# Altium schematic sheet DRS4_ADC.SchDoc: My title
size A3; Organization: University of California; Address1: 475 Portola Plaza; Address2: Los Angeles, CA 90095; Revision: R01; SheetNumber: 1; SheetTotal: 1
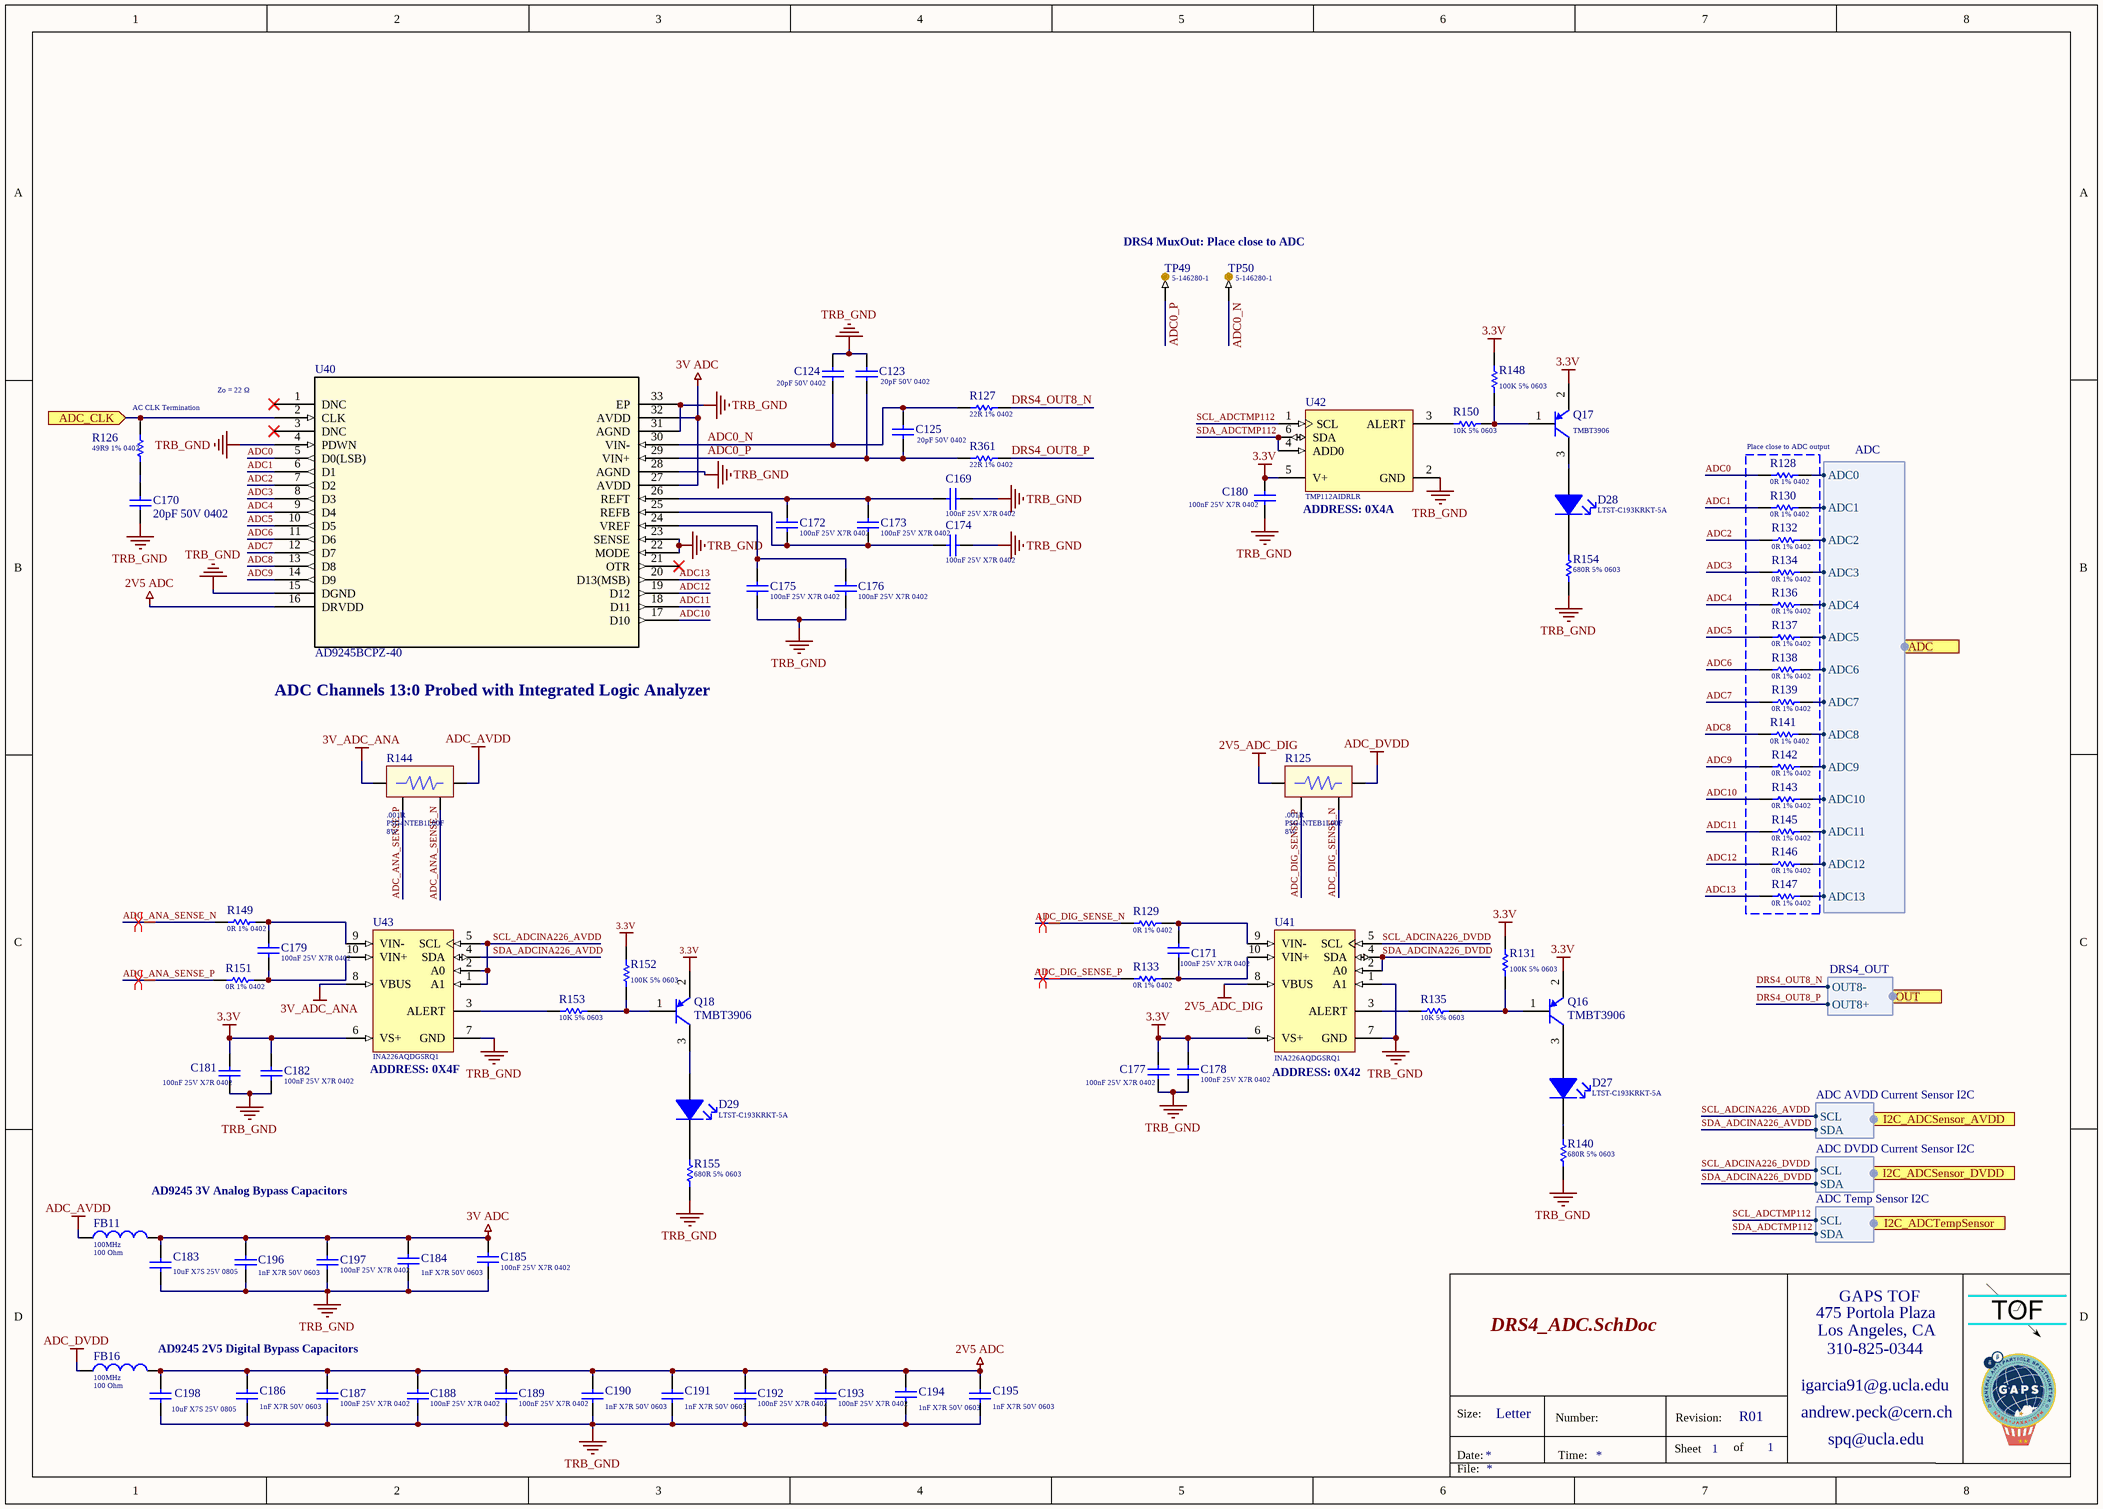
[diagram p0: DRS4_ADC.SchDoc]

## Parts
C123  Capacitance: 20pF 50V 0402  [Cap_Murata_GJM1555C1H200GB01D_20pF]  (hidden comment: Cap_Murata_GJM1555C1H200GB01D_20pF)
C124  Capacitance: 20pF 50V 0402  [Cap_Murata_GJM1555C1H200GB01D_20pF]  (hidden comment: Cap_Murata_GJM1555C1H200GB01D_20pF)
C125  Capacitance: 20pF 50V 0402  [Cap_Murata_GJM1555C1H200GB01D_20pF]  (hidden comment: Cap_Murata_GJM1555C1H200GB01D_20pF)
C169  Capacitance: 100nF 25V X7R 0402  [Cap_Taiyo_Yuden_TMK105B7104KV-FR_100nF]  (hidden comment: Cap_Taiyo_Yuden_TMK105B7104KV-FR_100nF)
C170  Capacitance: 20pF 50V 0402  [Cap_Murata_GJM1555C1H200GB01D_20pF]  (hidden comment: Cap_Murata_GJM1555C1H200GB01D_20pF)
C171  Capacitance: 100nF 25V X7R 0402  [Cap_Taiyo_Yuden_TMK105B7104KV-FR_100nF]  (hidden comment: Cap_Taiyo_Yuden_TMK105B7104KV-FR_100nF)
C172  Capacitance: 100nF 25V X7R 0402  [Cap_Taiyo_Yuden_TMK105B7104KV-FR_100nF]  (hidden comment: Cap_Taiyo_Yuden_TMK105B7104KV-FR_100nF)
C173  Capacitance: 100nF 25V X7R 0402  [Cap_Taiyo_Yuden_TMK105B7104KV-FR_100nF]  (hidden comment: Cap_Taiyo_Yuden_TMK105B7104KV-FR_100nF)
C174  Capacitance: 100nF 25V X7R 0402  [Cap_Taiyo_Yuden_TMK105B7104KV-FR_100nF]  (hidden comment: Cap_Taiyo_Yuden_TMK105B7104KV-FR_100nF)
C175  Capacitance: 100nF 25V X7R 0402  [Cap_Taiyo_Yuden_TMK105B7104KV-FR_100nF]  (hidden comment: Cap_Taiyo_Yuden_TMK105B7104KV-FR_100nF)
C176  Capacitance: 100nF 25V X7R 0402  [Cap_Taiyo_Yuden_TMK105B7104KV-FR_100nF]  (hidden comment: Cap_Taiyo_Yuden_TMK105B7104KV-FR_100nF)
C177  Capacitance: 100nF 25V X7R 0402  [Cap_Taiyo_Yuden_TMK105B7104KV-FR_100nF]  (hidden comment: Cap_Taiyo_Yuden_TMK105B7104KV-FR_100nF)
C178  Capacitance: 100nF 25V X7R 0402  [Cap_Taiyo_Yuden_TMK105B7104KV-FR_100nF]  (hidden comment: Cap_Taiyo_Yuden_TMK105B7104KV-FR_100nF)
C179  Capacitance: 100nF 25V X7R 0402  [Cap_Taiyo_Yuden_TMK105B7104KV-FR_100nF]  (hidden comment: Cap_Taiyo_Yuden_TMK105B7104KV-FR_100nF)
C180  Capacitance: 100nF 25V X7R 0402  [Cap_Taiyo_Yuden_TMK105B7104KV-FR_100nF]  (hidden comment: Cap_Taiyo_Yuden_TMK105B7104KV-FR_100nF)
C181  Capacitance: 100nF 25V X7R 0402  [Cap_Taiyo_Yuden_TMK105B7104KV-FR_100nF]  (hidden comment: Cap_Taiyo_Yuden_TMK105B7104KV-FR_100nF)
C182  Capacitance: 100nF 25V X7R 0402  [Cap_Taiyo_Yuden_TMK105B7104KV-FR_100nF]  (hidden comment: Cap_Taiyo_Yuden_TMK105B7104KV-FR_100nF)
C183  Capacitance: 10uF X7S 25V 0805  [Cap_Murata_ GRM21BC71E106ME11L_10uF]  (hidden comment: Cap_Murata_ GRM21BC71E106ME11L_10uF)
C184  Capacitance: 1nF X7R 50V 0603  [Cap_Kemet_C0603C102J5RACAUTO_1nF]  (hidden comment: Cap_Kemet_C0603C102J5RACAUTO_1nF)
C185  Capacitance: 100nF 25V X7R 0402  [Cap_Taiyo_Yuden_TMK105B7104KV-FR_100nF]  (hidden comment: Cap_Taiyo_Yuden_TMK105B7104KV-FR_100nF)
C186  Capacitance: 1nF X7R 50V 0603  [Cap_Kemet_C0603C102J5RACAUTO_1nF]  (hidden comment: Cap_Kemet_C0603C102J5RACAUTO_1nF)
C187  Capacitance: 100nF 25V X7R 0402  [Cap_Taiyo_Yuden_TMK105B7104KV-FR_100nF]  (hidden comment: Cap_Taiyo_Yuden_TMK105B7104KV-FR_100nF)
C188  Capacitance: 100nF 25V X7R 0402  [Cap_Taiyo_Yuden_TMK105B7104KV-FR_100nF]  (hidden comment: Cap_Taiyo_Yuden_TMK105B7104KV-FR_100nF)
C189  Capacitance: 100nF 25V X7R 0402  [Cap_Taiyo_Yuden_TMK105B7104KV-FR_100nF]  (hidden comment: Cap_Taiyo_Yuden_TMK105B7104KV-FR_100nF)
C190  Capacitance: 1nF X7R 50V 0603  [Cap_Kemet_C0603C102J5RACAUTO_1nF]  (hidden comment: Cap_Kemet_C0603C102J5RACAUTO_1nF)
C191  Capacitance: 1nF X7R 50V 0603  [Cap_Kemet_C0603C102J5RACAUTO_1nF]  (hidden comment: Cap_Kemet_C0603C102J5RACAUTO_1nF)
C192  Capacitance: 100nF 25V X7R 0402  [Cap_Taiyo_Yuden_TMK105B7104KV-FR_100nF]  (hidden comment: Cap_Taiyo_Yuden_TMK105B7104KV-FR_100nF)
C193  Capacitance: 100nF 25V X7R 0402  [Cap_Taiyo_Yuden_TMK105B7104KV-FR_100nF]  (hidden comment: Cap_Taiyo_Yuden_TMK105B7104KV-FR_100nF)
C194  Capacitance: 1nF X7R 50V 0603  [Cap_Kemet_C0603C102J5RACAUTO_1nF]  (hidden comment: Cap_Kemet_C0603C102J5RACAUTO_1nF)
C195  Capacitance: 1nF X7R 50V 0603  [Cap_Kemet_C0603C102J5RACAUTO_1nF]  (hidden comment: Cap_Kemet_C0603C102J5RACAUTO_1nF)
C196  Capacitance: 1nF X7R 50V 0603  [Cap_Kemet_C0603C102J5RACAUTO_1nF]  (hidden comment: Cap_Kemet_C0603C102J5RACAUTO_1nF)
C197  Capacitance: 100nF 25V X7R 0402  [Cap_Taiyo_Yuden_TMK105B7104KV-FR_100nF]  (hidden comment: Cap_Taiyo_Yuden_TMK105B7104KV-FR_100nF)
C198  Capacitance: 10uF X7S 25V 0805  [Cap_Murata_ GRM21BC71E106ME11L_10uF]  (hidden comment: Cap_Murata_ GRM21BC71E106ME11L_10uF)
D27  LTST-C193KRKT-5A  [Led_Lite-On_LTST-C193KGKT-5A_Red]
D28  LTST-C193KRKT-5A  [Led_Lite-On_LTST-C193KGKT-5A_Red]
D29  LTST-C193KRKT-5A  [Led_Lite-On_LTST-C193KGKT-5A_Red]
FB11  Measuring Frequency: 100MHz  Impedance: 100 Ohm  [FB_Wurth_Electronics_742792731_100Ohms]  (hidden comment: 742792731)
FB16  Measuring Frequency: 100MHz  Impedance: 100 Ohm  [FB_Wurth_Electronics_742792731_100Ohms]  (hidden comment: 742792731)
Q16  Series: TMBT3906  [BJT_PNP_Toshiba_TMBT3906]  (hidden comment: BJT_PNP_Toshiba_TMBT3906)
Q17  Series: TMBT3906  [BJT_PNP_Toshiba_TMBT3906]  (hidden comment: BJT_PNP_Toshiba_TMBT3906)
Q18  Series: TMBT3906  [BJT_PNP_Toshiba_TMBT3906]  (hidden comment: BJT_PNP_Toshiba_TMBT3906)
R125  Resistance: .001R  Series: PSG4NTEB1L00F  Parameter 1: 8W  [SRes_KOA_PSG4NTEB1L00F_1mOhm]  (hidden comment: SRes_KOA_PSG4NTEB1L00F_1mOhm)
R126  49R9 1% 0402  [RESC0402(1005)_L]
R127  22R 1% 0402  [RESC0402(1005)_L]
R128  Resistance: 0R 1% 0402  [Res_Vishay_CRCW04020000Z0EDC_0_Ohm]  (hidden comment: Res_Vishay_CRCW04020000Z0EDC_0_Ohm)
R129  Resistance: 0R 1% 0402  [Res_Vishay_CRCW04020000Z0EDC_0_Ohm]  (hidden comment: Res_Vishay_CRCW04020000Z0EDC_0_Ohm)
R130  Resistance: 0R 1% 0402  [Res_Vishay_CRCW04020000Z0EDC_0_Ohm]  (hidden comment: Res_Vishay_CRCW04020000Z0EDC_0_Ohm)
R131  100K 5% 0603  [RESC0603(1608)_N]
R132  Resistance: 0R 1% 0402  [Res_Vishay_CRCW04020000Z0EDC_0_Ohm]  (hidden comment: Res_Vishay_CRCW04020000Z0EDC_0_Ohm)
R133  Resistance: 0R 1% 0402  [Res_Vishay_CRCW04020000Z0EDC_0_Ohm]  (hidden comment: Res_Vishay_CRCW04020000Z0EDC_0_Ohm)
R134  Resistance: 0R 1% 0402  [Res_Vishay_CRCW04020000Z0EDC_0_Ohm]  (hidden comment: Res_Vishay_CRCW04020000Z0EDC_0_Ohm)
R135  10K 5% 0603  [RESC0603(1608)_L]
R136  Resistance: 0R 1% 0402  [Res_Vishay_CRCW04020000Z0EDC_0_Ohm]  (hidden comment: Res_Vishay_CRCW04020000Z0EDC_0_Ohm)
R137  Resistance: 0R 1% 0402  [Res_Vishay_CRCW04020000Z0EDC_0_Ohm]  (hidden comment: Res_Vishay_CRCW04020000Z0EDC_0_Ohm)
R138  Resistance: 0R 1% 0402  [Res_Vishay_CRCW04020000Z0EDC_0_Ohm]  (hidden comment: Res_Vishay_CRCW04020000Z0EDC_0_Ohm)
R139  Resistance: 0R 1% 0402  [Res_Vishay_CRCW04020000Z0EDC_0_Ohm]  (hidden comment: Res_Vishay_CRCW04020000Z0EDC_0_Ohm)
R140  680R 5% 0603  [RESC0603(1608)_L]
R141  Resistance: 0R 1% 0402  [Res_Vishay_CRCW04020000Z0EDC_0_Ohm]  (hidden comment: Res_Vishay_CRCW04020000Z0EDC_0_Ohm)
R142  Resistance: 0R 1% 0402  [Res_Vishay_CRCW04020000Z0EDC_0_Ohm]  (hidden comment: Res_Vishay_CRCW04020000Z0EDC_0_Ohm)
R143  Resistance: 0R 1% 0402  [Res_Vishay_CRCW04020000Z0EDC_0_Ohm]  (hidden comment: Res_Vishay_CRCW04020000Z0EDC_0_Ohm)
R144  Resistance: .001R  Series: PSG4NTEB1L00F  Parameter 1: 8W  [SRes_KOA_PSG4NTEB1L00F_1mOhm]  (hidden comment: SRes_KOA_PSG4NTEB1L00F_1mOhm)
R145  Resistance: 0R 1% 0402  [Res_Vishay_CRCW04020000Z0EDC_0_Ohm]  (hidden comment: Res_Vishay_CRCW04020000Z0EDC_0_Ohm)
R146  Resistance: 0R 1% 0402  [Res_Vishay_CRCW04020000Z0EDC_0_Ohm]  (hidden comment: Res_Vishay_CRCW04020000Z0EDC_0_Ohm)
R147  Resistance: 0R 1% 0402  [Res_Vishay_CRCW04020000Z0EDC_0_Ohm]  (hidden comment: Res_Vishay_CRCW04020000Z0EDC_0_Ohm)
R148  100K 5% 0603  [RESC0603(1608)_N]
R149  Resistance: 0R 1% 0402  [Res_Vishay_CRCW04020000Z0EDC_0_Ohm]  (hidden comment: Res_Vishay_CRCW04020000Z0EDC_0_Ohm)
R150  10K 5% 0603  [RESC0603(1608)_L]
R151  Resistance: 0R 1% 0402  [Res_Vishay_CRCW04020000Z0EDC_0_Ohm]  (hidden comment: Res_Vishay_CRCW04020000Z0EDC_0_Ohm)
R152  100K 5% 0603  [RESC0603(1608)_N]
R153  10K 5% 0603  [RESC0603(1608)_L]
R154  680R 5% 0603  [RESC0603(1608)_L]
R155  680R 5% 0603  [RESC0603(1608)_L]
R361  22R 1% 0402  [RESC0402(1005)_L]
TP49  Series: 5-146280-1  [TP_TE_Connectivity_5-146280-1_1POS]  (hidden comment: TP_TE_Connectivity_5-146280-1_1POS)
TP50  Series: 5-146280-1  [TP_TE_Connectivity_5-146280-1_1POS]  (hidden comment: TP_TE_Connectivity_5-146280-1_1POS)
U40  AD9245  [CP_32_2]  (value not drawn)
U41  INA226AQDGSRQ1  [INA226AQDGSRQ1]
U42  TMP112AIDRLR  [TMP112AIDRLR]
U43  INA226AQDGSRQ1  [INA226AQDGSRQ1]

## Blocks framed on the sheet
Place close to ADC output: R128 R130 R132 R134 R136-R139 R141-R143 R145-R147

## Ports
ADC (harness ADC), ADC_CLK (in), I2C_ADCSensor_AVDD (harness ADC AVDD Current Sensor I2C), I2C_ADCSensor_DVDD (harness ADC DVDD Current Sensor I2C), I2C_ADCTempSensor (harness ADC Temp Sensor I2C), OUT (harness DRS4_OUT)

## Harnesses
ADC: ADC0, ADC1, ADC2, ADC3, ADC4, ADC5, ADC6, ADC7, ADC8, ADC9, ADC10, ADC11, ADC12, ADC13
DRS4_OUT: OUT8+, OUT8-
ADC AVDD Current Sensor I2C: SCL, SDA
ADC Temp Sensor I2C: SCL, SDA
ADC DVDD Current Sensor I2C: SCL, SDA

## Nets
2V5 ADC: C186.2 C187.1 C188.1 C189.1 C190.2 C191.2 C192.1 C193.1 C194.2 C195.2 C198.1 FB16.2 U40.16(DRVDD)
2V5_ADC_DIG: R125.1 U41.8(VBUS)
3.3V: C177.2 C178.2 C180.1 C181.2 C182.2 Q16.2(E) Q17.2(E) Q18.2(E) R131.2 R148.2 R152.2 U41.6(VS+) U42.5(V+) U43.6(VS+)
3V ADC: C183.1 C184.2 C185.1 C196.2 C197.1 FB11.2 U40.27(AVDD) U40.32(AVDD)
3V_ADC_ANA: R144.1 U43.8(VBUS)
ADC_AVDD: FB11.1 R144.2
ADC_DVDD: FB16.1 R125.2
TRB_GND: C123.2 C124.2 C169.1 C170.1 C174.1 C175.2 C176.2 C177.1 C178.1 C180.2 C181.1 C182.1 C183.2 C184.1 C185.2 C186.1 C187.2 C188.2 C189.2 C190.1 C191.1 C192.2 C193.2 C194.1 C195.1 C196.1 C197.2 C198.2 R140.1 R154.1 R155.1 U40.4(PDWN) U40.15(DGND) U40.22(MODE) U40.23(SENSE) U40.28(AGND) U40.31(AGND) U40.33(EP) U41.1(A1) U41.7(GND) U42.2(GND) U43.7(GND)
ADC0: R128.1 U40.5(D0(LSB))
ADC0_N: C124.1 C125.2 R127.2 TP50.1 U40.30(VIN-)
ADC0_P: C123.1 C125.1 R361.2 TP49.1 U40.29(VIN+)
ADC1: R130.1 U40.6(D1)
ADC2: R132.1 U40.7(D2)
ADC3: R134.1 U40.8(D3)
ADC4: R136.1 U40.9(D4)
ADC5: R137.1 U40.10(D5)
ADC6: R138.1 U40.11(D6)
ADC7: R139.1 U40.12(D7)
ADC8: R141.1 U40.13(D8)
ADC9: R142.1 U40.14(D9)
ADC10: R143.1 U40.17(D10)
ADC11: R145.1 U40.18(D11)
ADC12: R146.1 U40.19(D12)
ADC13: R147.1 U40.20(D13(MSB))
ADC_ANA_SENSE_N: R144.3 R149.1
ADC_ANA_SENSE_P: R144.4 R151.1
ADC_CLK: R126.2 U40.2(CLK) ; port ADC_CLK
ADC_DIG_SENSE_N: R125.3 R129.1
ADC_DIG_SENSE_P: R125.4 R133.1
DRS4_OUT8_N: R127.1 ; port OUT.OUT8-
DRS4_OUT8_P: R361.1 ; port OUT.OUT8+
SCL_ADCINA226_AVDD: U43.1(A1) U43.2(A0) U43.5(SCL) ; port I2C_ADCSensor_AVDD.SCL
SCL_ADCINA226_DVDD: U41.5(SCL) ; port I2C_ADCSensor_DVDD.SCL
SCL_ADCTMP112: U42.1(SCL) ; port I2C_ADCTempSensor.SCL
SDA_ADCINA226_AVDD: U43.4(SDA) ; port I2C_ADCSensor_AVDD.SDA
SDA_ADCINA226_DVDD: U41.2(A0) U41.4(SDA) ; port I2C_ADCSensor_DVDD.SDA
SDA_ADCTMP112: U42.4(ADD0) U42.6(SDA) ; port I2C_ADCTempSensor.SDA
NetC169_2: C169.2 C172.1 C173.1 U40.26(REFT)
NetC170_2: C170.2 R126.1
NetC171_1: C171.1 R133.2 U41.10(VIN+)
NetC171_2: C171.2 R129.2 U41.9(VIN-)
NetC172_2: C172.2 C173.2 C174.2 U40.25(REFB)
NetC175_1: C175.1 C176.1 U40.24(VREF)
NetC179_1: C179.1 R151.2 U43.10(VIN+)
NetC179_2: C179.2 R149.2 U43.9(VIN-)
NetD27_1: D27.1(K) R140.2
NetD27_2: D27.2(A) Q16.3(C)
NetD28_1: D28.1(K) R154.2
NetD28_2: D28.2(A) Q17.3(C)
NetD29_1: D29.1(K) R155.2
NetD29_2: D29.2(A) Q18.3(C)
NetQ16_1: Q16.1(B) R131.1 R135.1
NetQ17_1: Q17.1(B) R148.1 R150.1
NetQ18_1: Q18.1(B) R152.1 R153.1
NetR128_2: R128.2 ; port ADC.ADC0
NetR130_2: R130.2 ; port ADC.ADC1
NetR132_2: R132.2 ; port ADC.ADC2
NetR134_2: R134.2 ; port ADC.ADC3
NetR135_2: R135.2 U41.3(ALERT)
NetR136_2: R136.2 ; port ADC.ADC4
NetR137_2: R137.2 ; port ADC.ADC5
NetR138_2: R138.2 ; port ADC.ADC6
NetR139_2: R139.2 ; port ADC.ADC7
NetR141_2: R141.2 ; port ADC.ADC8
NetR142_2: R142.2 ; port ADC.ADC9
NetR143_2: R143.2 ; port ADC.ADC10
NetR145_2: R145.2 ; port ADC.ADC11
NetR146_2: R146.2 ; port ADC.ADC12
NetR147_2: R147.2 ; port ADC.ADC13
NetR150_2: R150.2 U42.3(ALERT)
NetR153_2: R153.2 U43.3(ALERT)

Not connected (* = marked no-connect by the designer): U40 1(DNC)* 3(DNC)* 21(OTR)*

## Layout directives
differential pair: ADC_ANA_SENSE_N, ADC_ANA_SENSE_P, ADC_DIG_SENSE_N, ADC_DIG_SENSE_P

## Notes on the sheet
- DRS4 MuxOut: Place close to ADC
- (near R126) AC CLK Termination
- Zo = 22 Ω
- ADDRESS: 0X4A
- ADC Channels 13:0 Probed with Integrated Logic Analyzer
- (near U43) ADDRESS: 0X4F
- (near U41) ADDRESS: 0X42
- AD9245 3V Analog Bypass Capacitors
- (near FB16) AD9245 2V5 Digital Bypass Capacitors
- 475 Portola Plaza
- GAPS TOF
- igarcia91@g.ucla.edu
- Los Angeles, CA
- 310-825-0344
- Size:
- Date:
- Letter
- Number:
- Time:
- Sheet
- Revision:
- of
- andrew.peck@cern.ch
- spq@ucla.edu
- File:

## Library data of the parts
C123-C125 C170 = Cap_Murata_GJM1555C1H200GB01D_20pF: Multilayer Ceramic Capacitors MLCC - SMD/SMT 0402 20pF 50Volts C0G 2%; Supplier 1: Mouser; Supplier Part Number 1: 81-GJM1555C1H200GB01
C169 C171-C182 C185 C187-C189 C192 C193 C197 = Cap_Taiyo_Yuden_TMK105B7104KV-FR_100nF: CAP CER 100nF 25V X7R 0402; Supplier 1: Mouser; Supplier Part Number 1: 963-TMK105B7104KV-FR
C183 C198 = Cap_Murata_ GRM21BC71E106ME11L_10uF: CAP CER 10uF 25V X7R 0805; Supplier 1: Mouser; Supplier Part Number 1: 81-GRM21BC71E106ME1L
C184 C186 C190 C191 C194-C196 = Cap_Kemet_C0603C102J5RACAUTO_1nF: CAP CER 1nF 50V X7R 0603; Supplier 1: Mouser; Supplier Part Number 1: 80-C0603C102J5RAUTO
D27-D29 = Led_Lite-On_LTST-C193KGKT-5A_Red: Standard LEDs - SMD Red 470nm 28mcd 20mA; Supplier 1: Mouser; Supplier Part Number 1: 859-LTSTC193KRKT5A; Series: LTST-C193KRKT-5A
FB11 FB16 = FB_Wurth_Electronics_742792731_100Ohms: FB SMD 100 OHM 25% 1.2A 0402; DC Resistance: 90mOhm; Supplier 1: Mouser; Supplier Part Number 1: 710-742792731
Q16-Q18 = BJT_PNP_Toshiba_TMBT3906: Bipolar Transistors - BJT Transistor for Low Freq. Amplification; Supplier 1: Mouser; Supplier Part Number 1: TMBT3906,LM
R125 R144 = SRes_KOA_PSG4NTEB1L00F_1mOhm: Current Sense Resistors - SMD 1mOhm 8W 1% 50ppm AEC-Q200 Power Shunt; Supplier 1: Mouser; Supplier Part Number 1: 660-PSG4NTEB1L00F
R126 = CMP-1011-00363-1: 49R9 0.063W 1% 0402 (1005 Metric)  SMD; Case-EIA: 0402; Case-Metric: 1005; Value: 49.90 Ohm; Power: 0.063 W; Technology: SMT; Tolerance: 1 %
R127 R361 = CMP-1011-00320-1: 22R 0.063W 1% 0402 (1005 Metric)  SMD; Case-EIA: 0402; Case-Metric: 1005; Value: 22.00 Ohm; Tolerance: 1 %; Technology: SMT; Power: 0.063 W
R128-R130 R132-R134 R136-R139 R141-R143 R145-R147 R149 R151 = Res_Vishay_CRCW04020000Z0EDC_0_Ohm: 0R 0.062W 1% 0402 (1005 Metric)  SMD; Supplier 1: Mouser; Supplier Part Number 1: 71-CRCW04020000Z0EDC
R131 R148 R152 = CMP-1012-00122-1: 100K 0.1W 5% 0603 (1608 Metric)  SMD; Case-EIA: 0603; Value: 100000.00 Ohm; Case-Metric: 1608; Tolerance: 5 %; Power: 0.1 W; Technology: SMT
R135 R150 R153 = CMP-1012-00098-1: 10K 0.1W 5% 0603 (1608 Metric)  SMD; Case-EIA: 0603; Value: 10000.00 Ohm; Case-Metric: 1608; Technology: SMT; Tolerance: 5 %; Power: 0.1 W
R140 R154 R155 = CMP-1012-00070-1: 680R 0.1W 5% 0603 (1608 Metric)  SMD; Case-EIA: 0603; Value: 680.00 Ohm; Case-Metric: 1608; Tolerance: 5 %; Technology: SMT; Power: 0.1 W
TP49 TP50 = TP_TE_Connectivity_5-146280-1_1POS: Headers & Wire Housings Unshrouded 1 POS T/H; Supplier Part Number 1: 571-51462801; Supplier 1: Mouser
U40 = AD9245BCPZ-40: Analog to Digital Converters - ADC 14-Bit 40 MSPS 3V; Vendor: Analog Devices Inc; Built_By: EMA_UL_Team; C: Copyright (C) 2015 Accelerated Designs. All rights reserved; RefDes: RefDes; Type: DEV; Supplier 1: Mouser; Supplier Part Number 1: 584-AD9245BCPZ-40; Series: AD9245BCPZ-40; Part: AD9245BCPZ-40
U41 U43 = INA226AQDGSRQ1: Current & Power Monitors & Regulators Automotive, 36-V, Ultra-High Accuracy, Low-/High-Side, I2C Out Current/Power Monitor w/ Alert 10-VSSOP -40 to 125; Supplier 1: Mouser; Supplier Part Number 1: 595-INA226AQDGSRQ1
U42 = TMP112AIDRLR: Board Mount Temperature Sensors Hi-Prec Lo-Pwr Dig Temp Sensor; Supplier 1: Mouser; Supplier Part Number 1: 595-TMP112AIDRLR